# Altium schematic sheet SubBus13.SchDoc
size A
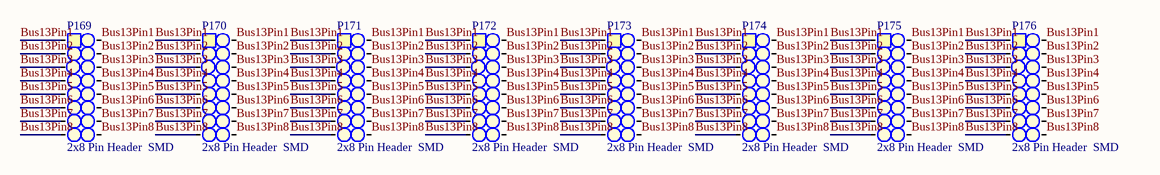
[diagram p0: SubBus13.SchDoc]

## Parts
P169  2x8 Pin Header  SMD  [2X8_SMD_PH_2.54]
P170  2x8 Pin Header  SMD  [2X8_SMD_PH_2.54]
P171  2x8 Pin Header  SMD  [2X8_SMD_PH_2.54]
P172  2x8 Pin Header  SMD  [2X8_SMD_PH_2.54]
P173  2x8 Pin Header  SMD  [2X8_SMD_PH_2.54]
P174  2x8 Pin Header  SMD  [2X8_SMD_PH_2.54]
P175  2x8 Pin Header  SMD  [2X8_SMD_PH_2.54]
P176  2x8 Pin Header  SMD  [2X8_SMD_PH_2.54]

## Nets
Bus13Pin1: P169.1 P169.16 P170.1 P170.16 P171.1 P171.16 P172.1 P172.16 P173.1 P173.16 P174.1 P174.16 P175.1 P175.16 P176.1 P176.16
Bus13Pin2: P169.2 P169.15 P170.2 P170.15 P171.2 P171.15 P172.2 P172.15 P173.2 P173.15 P174.2 P174.15 P175.2 P175.15 P176.2 P176.15
Bus13Pin3: P169.3 P169.14 P170.3 P170.14 P171.3 P171.14 P172.3 P172.14 P173.3 P173.14 P174.3 P174.14 P175.3 P175.14 P176.3 P176.14
Bus13Pin4: P169.4 P169.13 P170.4 P170.13 P171.4 P171.13 P172.4 P172.13 P173.4 P173.13 P174.4 P174.13 P175.4 P175.13 P176.4 P176.13
Bus13Pin5: P169.5 P169.12 P170.5 P170.12 P171.5 P171.12 P172.5 P172.12 P173.5 P173.12 P174.5 P174.12 P175.5 P175.12 P176.5 P176.12
Bus13Pin6: P169.6 P169.11 P170.6 P170.11 P171.6 P171.11 P172.6 P172.11 P173.6 P173.11 P174.6 P174.11 P175.6 P175.11 P176.6 P176.11
Bus13Pin7: P169.7 P169.10 P170.7 P170.10 P171.7 P171.10 P172.7 P172.10 P173.7 P173.10 P174.7 P174.10 P175.7 P175.10 P176.7 P176.10
Bus13Pin8: P169.8 P169.9 P170.8 P170.9 P171.8 P171.9 P172.8 P172.9 P173.8 P173.9 P174.8 P174.9 P175.8 P175.9 P176.8 P176.9

## Library data of the parts
P169-P176 = 2x8 Pin Header  SMD: 2.54mm, SMD; Value: 2x8 Pin Header, 2.54mm, SMD; Farnell: 2356242